# Altium schematic sheet PLD_Gyroscopes.SchDoc: Gyroscopes
size A4; SheetTotal: 32
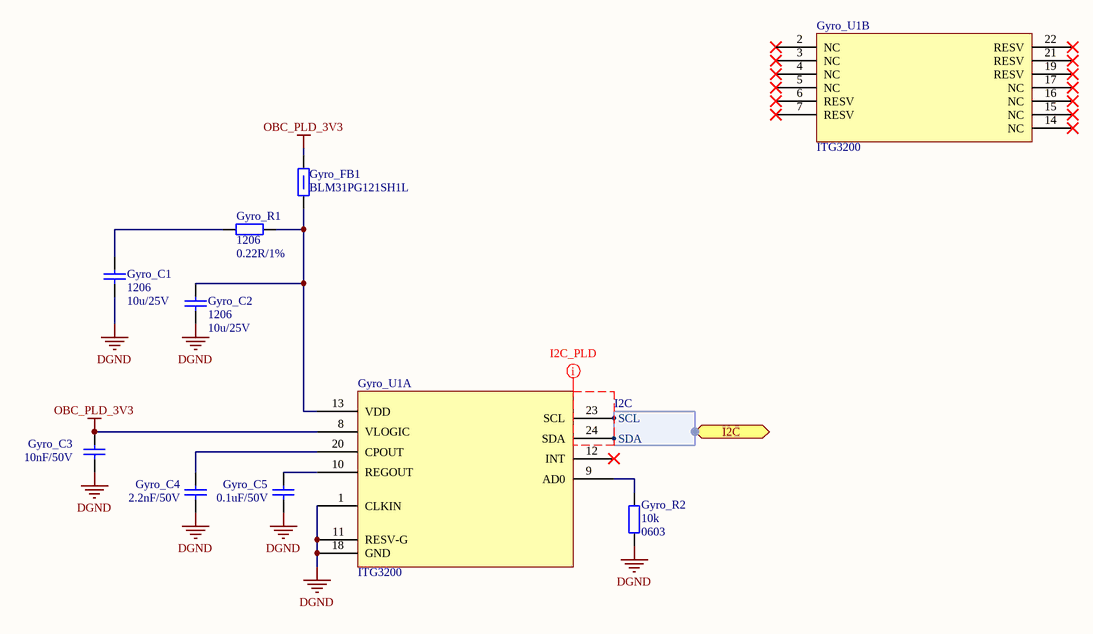
[diagram p0: PLD_Gyroscopes.SchDoc]

## Parts
Gyro_C1  Package: 1206  [SMD_Capacitor_1206]  (hidden comment: 10u/25V)
Gyro_C2  Package: 1206  [SMD_Capacitor_1206]  (hidden comment: 10u/25V)
Gyro_C3  10nF/50V  [SMD_Capacitor_0603]
Gyro_C4  2.2nF/50V  [SMD_Capacitor_0603]
Gyro_C5  0.1uF/50V  [SMD_Capacitor_0603]
Gyro_FB1  120R/100MHz  [SMD_FerriteBead_1206]  (value not drawn)
Gyro_R1  Package: 1206  [SMD_Resistor_1206]  (hidden comment: 0.22R/1%)
Gyro_R2  10k  Package: 0603  [SMD_Resistor_0603]
Gyro_U1  ITG3200  [QFN24_4x4]  (parts A,B of 2)

## Ports
I2C (harness I2C)

## Harnesses
I2C: SDA, SCL

## Nets
DGND: Gyro_C1.2 Gyro_C2.2 Gyro_C3.2 Gyro_C4.2 Gyro_C5.2 Gyro_R2.2 Gyro_U1.1(CLKIN) Gyro_U1.11(RESV-G) Gyro_U1.18(GND)
OBC_PLD_3V3: Gyro_C3.1 Gyro_FB1.1 Gyro_U1.8(VLOGIC)
NetGyro_C1_1: Gyro_C1.1 Gyro_R1.1
NetGyro_C2_1: Gyro_C2.1 Gyro_FB1.2 Gyro_R1.2 Gyro_U1.13(VDD)
NetGyro_C4_1: Gyro_C4.1 Gyro_U1.20(CPOUT)
NetGyro_C5_1: Gyro_C5.1 Gyro_U1.10(REGOUT)
NetGyro_R2_1: Gyro_R2.1 Gyro_U1.9(AD0)
NetGyro_U1_23: Gyro_U1.23(SCL) ; port I2C.SCL
NetGyro_U1_24: Gyro_U1.24(SDA) ; port I2C.SDA

Not connected (* = marked no-connect by the designer): Gyro_U1 2(NC)* 3(NC)* 4(NC)* 5(NC)* 6(RESV)* 7(RESV)* 12(INT)* 14(NC)* 15(NC)* 16(NC)* 17(NC)* 19(RESV)* 21(RESV)* 22(RESV)*

## Layout directives
net class I2C_PLD: (no net found under the mark)

## Notes on the sheet
- Title:
- Project:
- Author:
- Model:
- Document Number:
- Checked by:
- Rev:
- Date:
- Approved by:
- Sheet:
- of
- File name:

## Library data of the parts
Gyro_C1 Gyro_C2 = Cer_C1206T105K3RALTU: Ceramic Cap Kemet COTS 1u/25V X7R 1206; ManufacturerPartNumber: C1206T105K3RALTU; Manufacturer: Kemet; Value: 10u/25V
Gyro_C3-Gyro_C5 = Cer_C0603T104K5RALTU: Ceramic Cap Kemet COTS 100n/50V X7R 0603; Manufacturer: Kemet; ManufacturerPartNumber: C0603T104K5RALTU; Package: 0603
  Gyro_C3: Value: 10nF/50V
  Gyro_C4: Value: 2.2nF/50V
  Gyro_C5: Value: 0.1uF/50V
Gyro_FB1 = BLM31PG121SH1L: Ferrite bead, 1206, 0.02HM, 3.5A.; Manufacturer: Murata; Current Rating: 3.5A; Series Resistance DC: 0.02R; Package: 1206; Value: 120R/100MHz; ManufacturerPartNumber: BLM31PG121SH1L
Gyro_R1 = ERJ-8BQFR22V: Panasonic Resistor 0.22R 1% 1206 330mW; Manufacturer: Panasonic; ManufacturerPartNumber: ERJ-8BQFR22V; Value: 0.22R/1%
Gyro_R2 = Res: Value: Res